# EAGLE design grbl_pendant_peripheral (EAGLE 6.6.0)
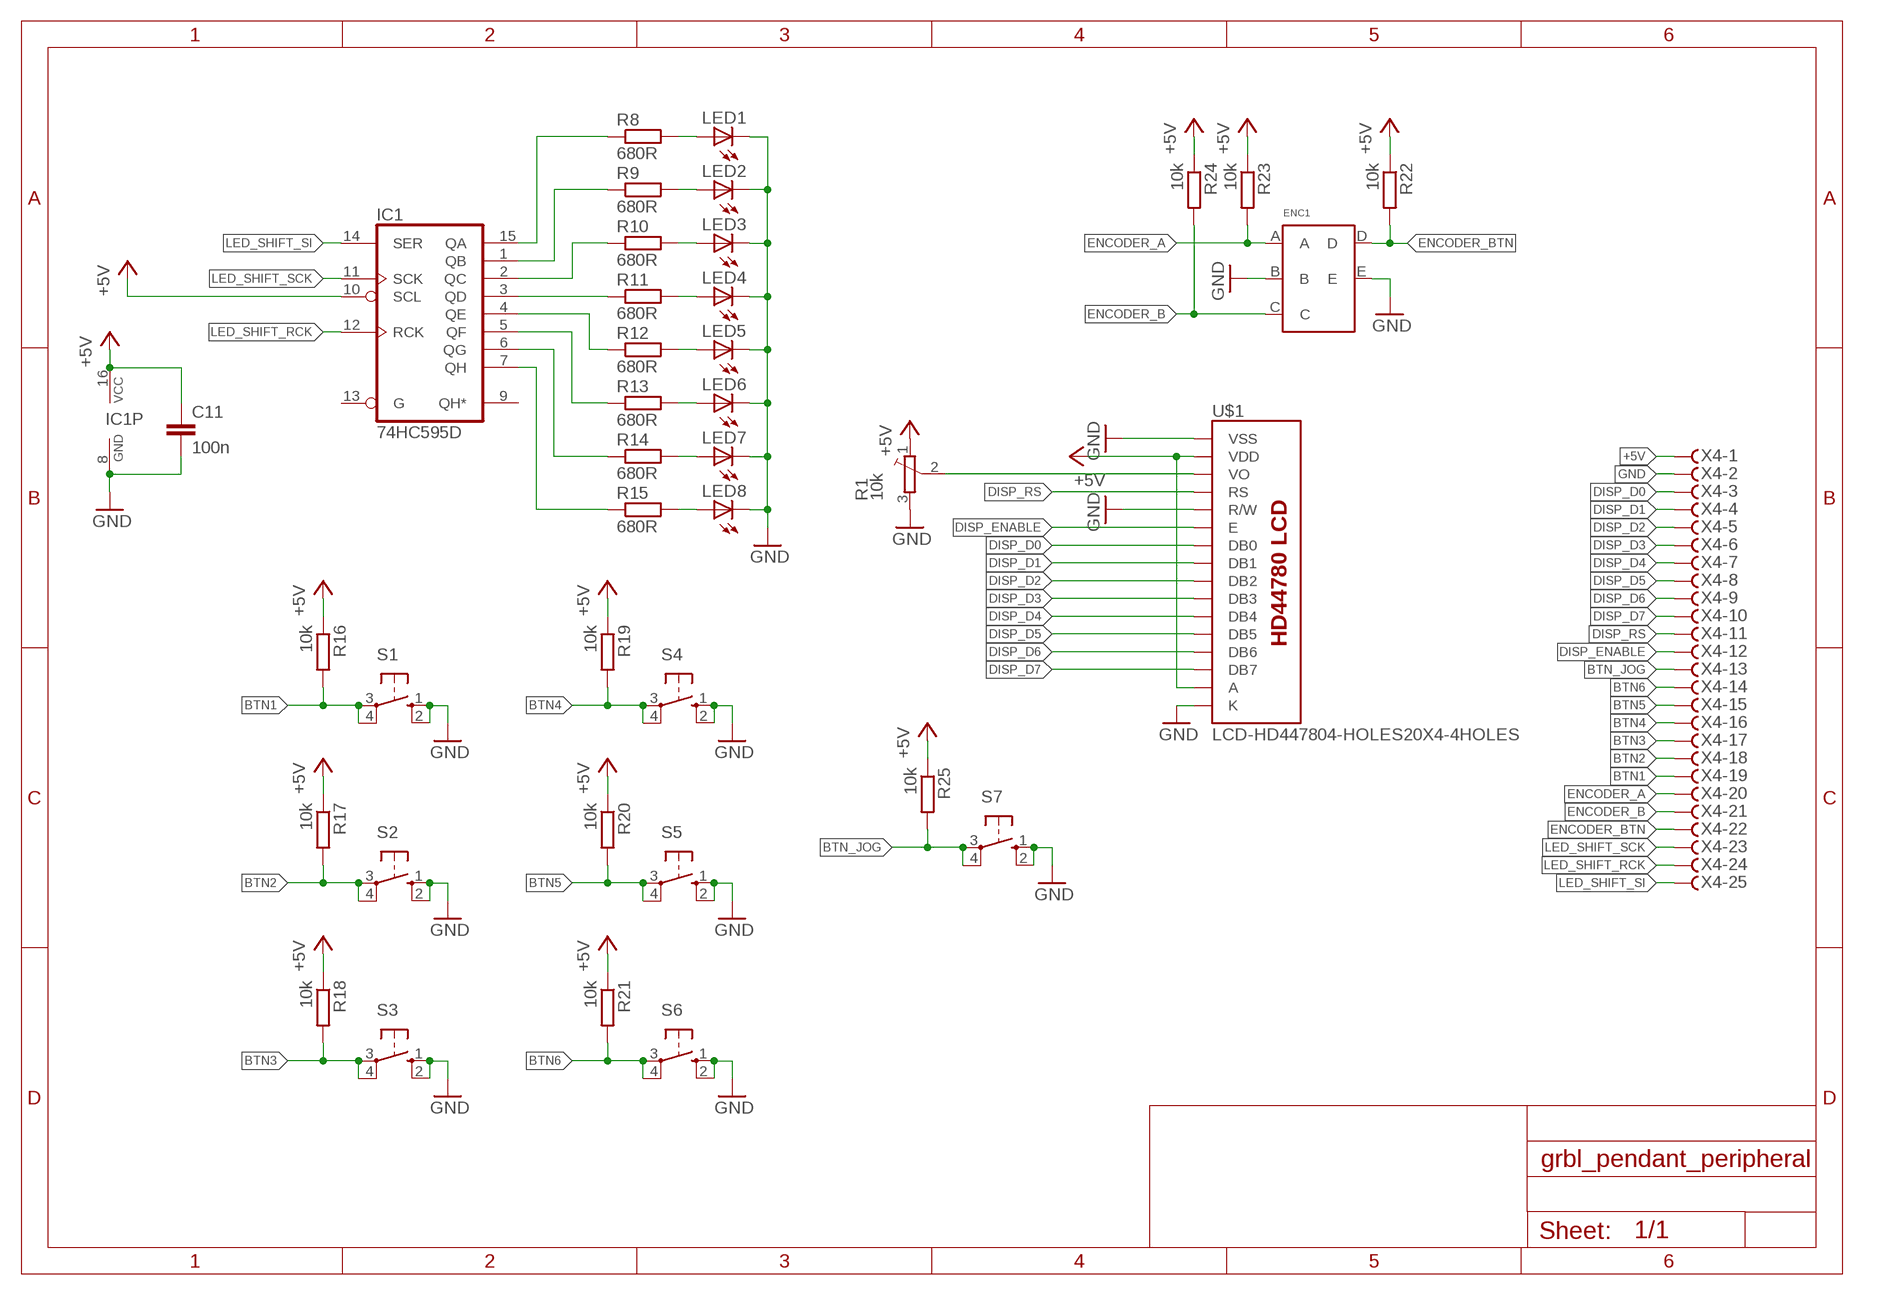
[diagram p0: schematic, sheet 1]

## Parts
C11  100n  C-EUC0603K  [C0603K]
ENC1  ENCODER  [ENCODER]
IC1  74HC595D  [SO16]
LED1  LED5MM  [LED5MM]
LED2  LED5MM  [LED5MM]
LED3  LED5MM  [LED5MM]
LED4  LED5MM  [LED5MM]
LED5  LED5MM  [LED5MM]
LED6  LED5MM  [LED5MM]
LED7  LED5MM  [LED5MM]
LED8  LED5MM  [LED5MM]
R1  10k  35WR5KLFTR  [35WR5KLFTR]
R8  680R  R-EU_R0603  [R0603]
R9  680R  R-EU_R0603  [R0603]
R10  680R  R-EU_R0603  [R0603]
R11  680R  R-EU_R0603  [R0603]
R12  680R  R-EU_R0603  [R0603]
R13  680R  R-EU_R0603  [R0603]
R14  680R  R-EU_R0603  [R0603]
R15  680R  R-EU_R0603  [R0603]
R16  10k  R-EU_R0603  [R0603]
R17  10k  R-EU_R0603  [R0603]
R18  10k  R-EU_R0603  [R0603]
R19  10k  R-EU_R0603  [R0603]
R20  10k  R-EU_R0603  [R0603]
R21  10k  R-EU_R0603  [R0603]
R22  10k  R-EU_R0603  [R0603]
R23  10k  R-EU_R0603  [R0603]
R24  10k  R-EU_R0603  [R0603]
R25  10k  R-EU_R0603  [R0603]
S1  10-XX  [B3F-10XX]
S2  10-XX  [B3F-10XX]
S3  10-XX  [B3F-10XX]
S4  10-XX  [B3F-10XX]
S5  10-XX  [B3F-10XX]
S6  10-XX  [B3F-10XX]
S7  10-XX  [B3F-10XX]
U$1  LCD-HD447804-HOLES20X4-4HOLES  [LCD-20X4-4HOLES]
X4  F25HPS  [F25HP]

## Nets
+5V: C11.1 IC1.10(SCL) IC1.16(VCC) R1.1(E) R16.1 R17.1 R18.1 R19.1 R20.1 R21.1 R22.1 R23.1 R24.1 R25.1 U$1.P$2(VDD) U$1.P$15(A) X4.1
BTN1: R16.2 S1.3(P) S1.4(P1) X4.19
BTN2: R17.2 S2.3(P) S2.4(P1) X4.18
BTN3: R18.2 S3.3(P) S3.4(P1) X4.17
BTN4: R19.2 S4.3(P) S4.4(P1) X4.16
BTN5: R20.2 S5.3(P) S5.4(P1) X4.15
BTN6: R21.2 S6.3(P) S6.4(P1) X4.14
BTN_JOG: R25.2 S7.3(P) S7.4(P1) X4.13
DISP_D0: U$1.P$7(DB0) X4.3
DISP_D1: U$1.P$8(DB1) X4.4
DISP_D2: U$1.P$9(DB2) X4.5
DISP_D3: U$1.P$10(DB3) X4.6
DISP_D4: U$1.P$11(DB4) X4.7
DISP_D5: U$1.P$12(DB5) X4.8
DISP_D6: U$1.P$13(DB6) X4.9
DISP_D7: U$1.P$14(DB7) X4.10
DISP_ENABLE: U$1.P$6(E) X4.12
DISP_RS: U$1.P$4(RS) X4.11
ENCODER_A: ENC1.A R23.2 X4.20
ENCODER_B: ENC1.C R24.2 X4.21
ENCODER_BTN: ENC1.D R22.2 X4.22
GND: C11.2 ENC1.B ENC1.E IC1.8(GND) LED1.K(C) LED2.K(C) LED3.K(C) LED4.K(C) LED5.K(C) LED6.K(C) LED7.K(C) LED8.K(C) R1.3(A) S1.1(S) S1.2(S1) S2.1(S) S2.2(S1) S3.1(S) S3.2(S1) S4.1(S) S4.2(S1) S5.1(S) S5.2(S1) S6.1(S) S6.2(S1) S7.1(S) S7.2(S1) U$1.P$1(VSS) U$1.P$5(R/W) U$1.P$16(K) X4.2
LED_SHIFT_RCK: IC1.12(RCK) X4.24
LED_SHIFT_SCK: IC1.11(SCK) X4.23
LED_SHIFT_SI: IC1.14(SER) X4.25
N$1: IC1.3(QD) R11.1
N$2: IC1.15(QA) R8.1
N$3: IC1.1(QB) R9.1
N$4: IC1.2(QC) R10.1
N$5: R1.2(S) U$1.P$3(VO)
N$6: IC1.4(QE) R12.1
N$9: IC1.5(QF) R13.1
N$10: IC1.6(QG) R14.1
N$11: IC1.7(QH) R15.1
N$12: LED1.A R8.2
N$13: LED2.A R9.2
N$14: LED3.A R10.2
N$15: LED4.A R11.2
N$16: LED5.A R12.2
N$17: LED6.A R13.2
N$18: LED7.A R14.2
N$19: LED8.A R15.2
Unconnected: IC1.9(QH*) IC1.13(G)

## Library data of the parts
C11 = rcl:C-EU: CAPACITOR, European symbol
ENC1 = encoder:ENCODER
IC1 = 74xx-eu:74*595: 8-bit SHIFT REGISTER, output latch
LED1-LED8 = led:LED: LED OSRAM: - CHIPLED LG R971, LG N971, LY N971, LG Q971, LY Q971, LO R971, LY R971 LH N974, LH R974 LS Q976, LO Q976, LY Q976 LO Q996 - Hyper CHIPLED LW Q18S LB Q993, LB Q99A, LB R99A - SideLED LS A670, LO A670, LY A670, LG A670, LP A670 LB A673, LV A673, LT A673, LW A673 LH A674 LY A675 LS A676, LA A676, LO A676, LY A676, LW A676 LS A679, LY A679, LG A679 - Hyper Micro SIDELED® LS Y876, LA Y876, LO Y876, LY Y876 LT Y87S - SmartLED LW L88C, LW L88S LB L89C, LB L89S, LG L890 LS L89K, LO L89K, LY L89K LS L896, LA L896, LO L896, LY L896 - TOPLED LS T670, LO T670, LY T670, LG T670, LP T670 LSG T670, LSP T670, LSY T670, LOP T670, LYG T670 LG T671, LOG T671, LSG T671 LB T673, LV T673, LT T673, LW T673 LH T674 LS T676, LA T676, LO T676, LY T676, LB T676, LH T676, LSB T676, LW T676 LB T67C, LV T67C, LT T67C, LS T67K, LO T67K, LY T67K, LW E67C LS E67B, LA E67B, LO E67B, LY E67B, LB E67C, LV E67C, LT E67C LW T67C LS T679, LY T679, LG T679 LS T770, LO T770, LY T770, LG T770, LP T770 LB T773, LV T773, LT T773, LW T773 LH T774 LS E675, LA E675, LY E675, LS T675 LS T776, LA T776, LO T776, LY T776, LB T776 LHGB T686 LT T68C, LB T68C - Hyper Mini TOPLED® LB M676 - Mini TOPLED Santana® LG M470 LS M47K, LO M47K, LY M47K Source: http://www.osram.convergy.de LUXEON: - LUMILED® LXK2-PW12-R00, LXK2-PW12-S00, LXK2-PW14-U00, LXK2-PW14-V00 LXK2-PM12-R00, LXK2-PM12-S00, LXK2-PM14-U00 LXK2-PE12-Q00, LXK2-PE12-R00, LXK2-PE12-S00, LXK2-PE14-T00, LXK2-PE14-U00 LXK2-PB12-K00, LXK2-PB12-L00, LXK2-PB12-M00, LXK2-PB14-N00, LXK2-PB14-P00, LXK2-PB14-Q00 LXK2-PR12-L00, LXK2-PR12-M00, LXK2-PR14-Q00, LXK2-PR14-R00 LXK2-PD12-Q00, LXK2-PD12-R00, LXK2-PD12-S00 LXK2-PH12-R00, LXK2-PH12-S00 LXK2-PL12-P00, LXK2-PL12-Q00, LXK2-PL12-R00 Source: www.luxeon.com KINGBRIGHT: KA-3528ASYC Source: www.kingbright.com
R1 = SchlegelAr_Master:35WR5KLFTR: 35WR5KLFTR - Trimmerwiderstände – SMD 5K OHM 3MM ST CERM last modified: Armin Schlegel, 28.04.2014 http://de.mouser.com/ProductDetail/BI-Technologies-TT-electronics/35WR5KLFTR/?qs=sGAEpiMZZMvygUB3GLcD7k0onkdf2zwbjj6v9Mqce6o%3d http://www.mouser.com/ds/2/414/35-2231.pdf
R8-R25 = rcl:R-EU_: RESISTOR, European symbol
S1-S7 = switch-omron:10-XX: OMRON SWITCH; MPN: B3F-1000; OC_FARNELL: 176432; OC_NEWARK: 36M3542
U$1 = HD44780LCD:LCD-HD44780
X4 = con-subd:F25?S: SUB-D; OC_FARNELL: unknown; OC_NEWARK: unknown

## Board
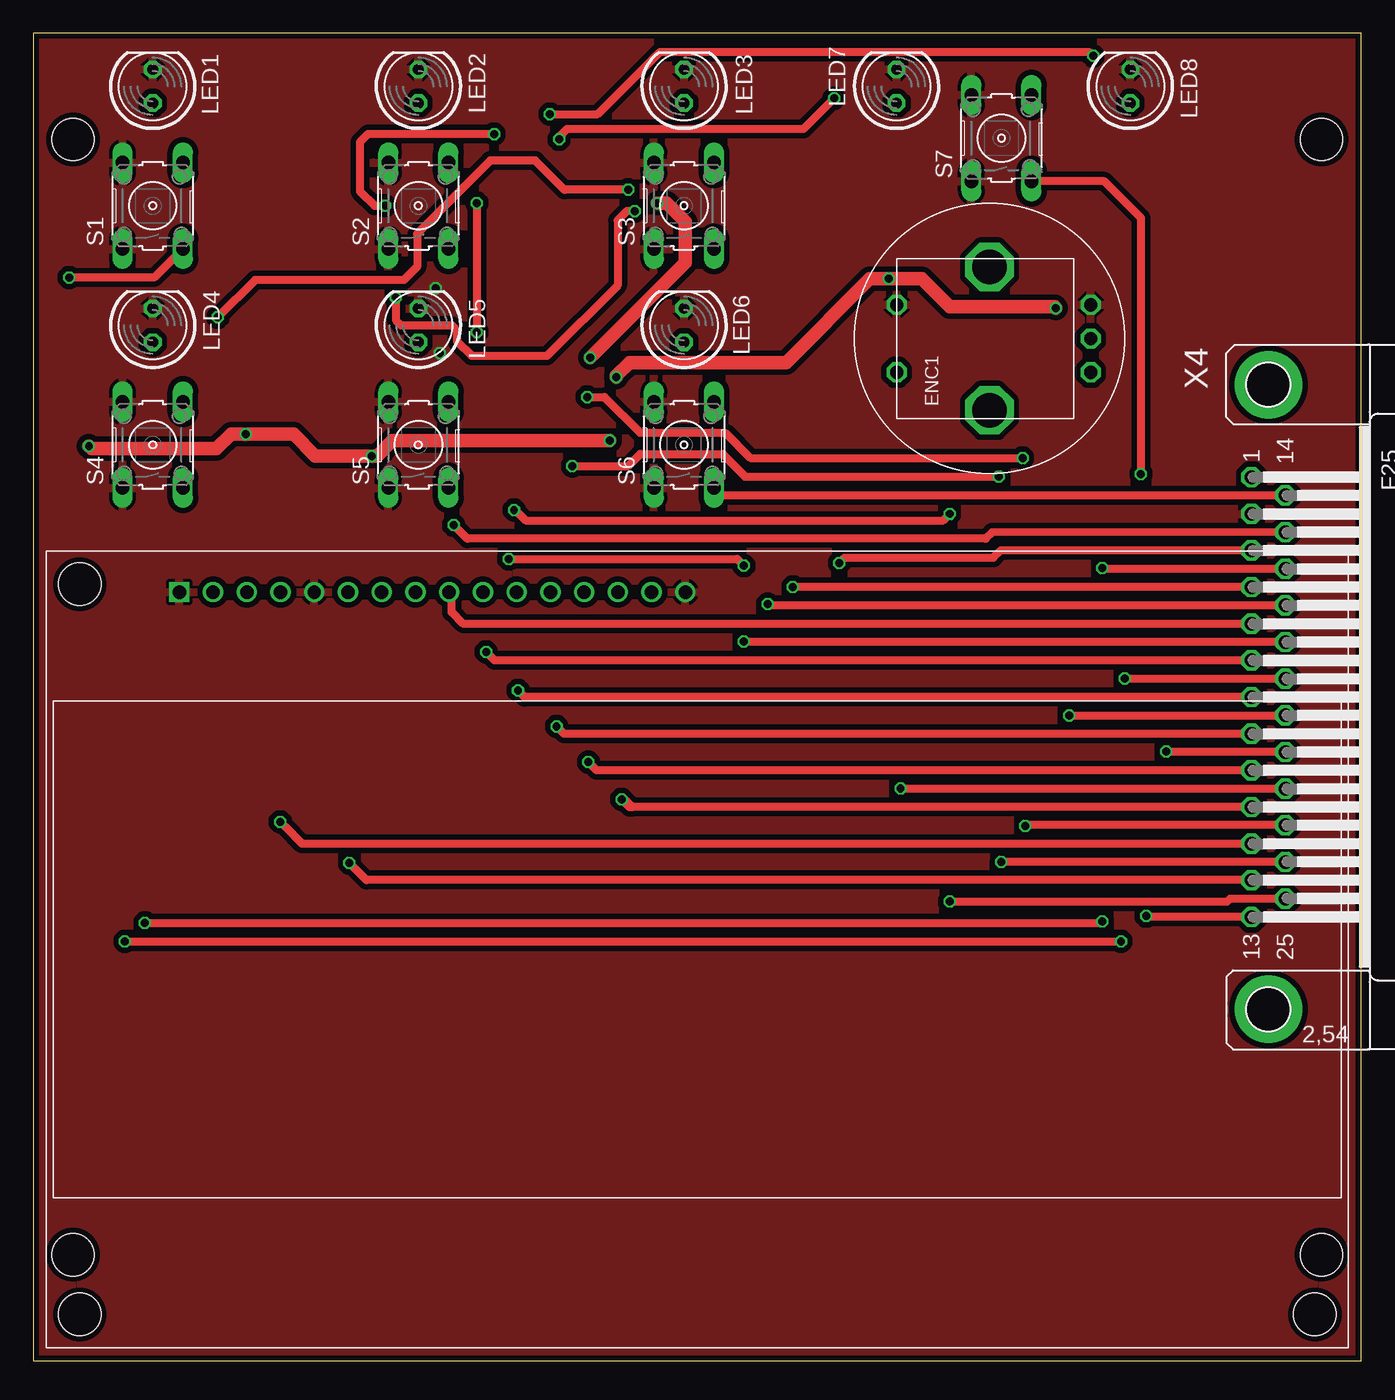
[diagram p1: board, top side]
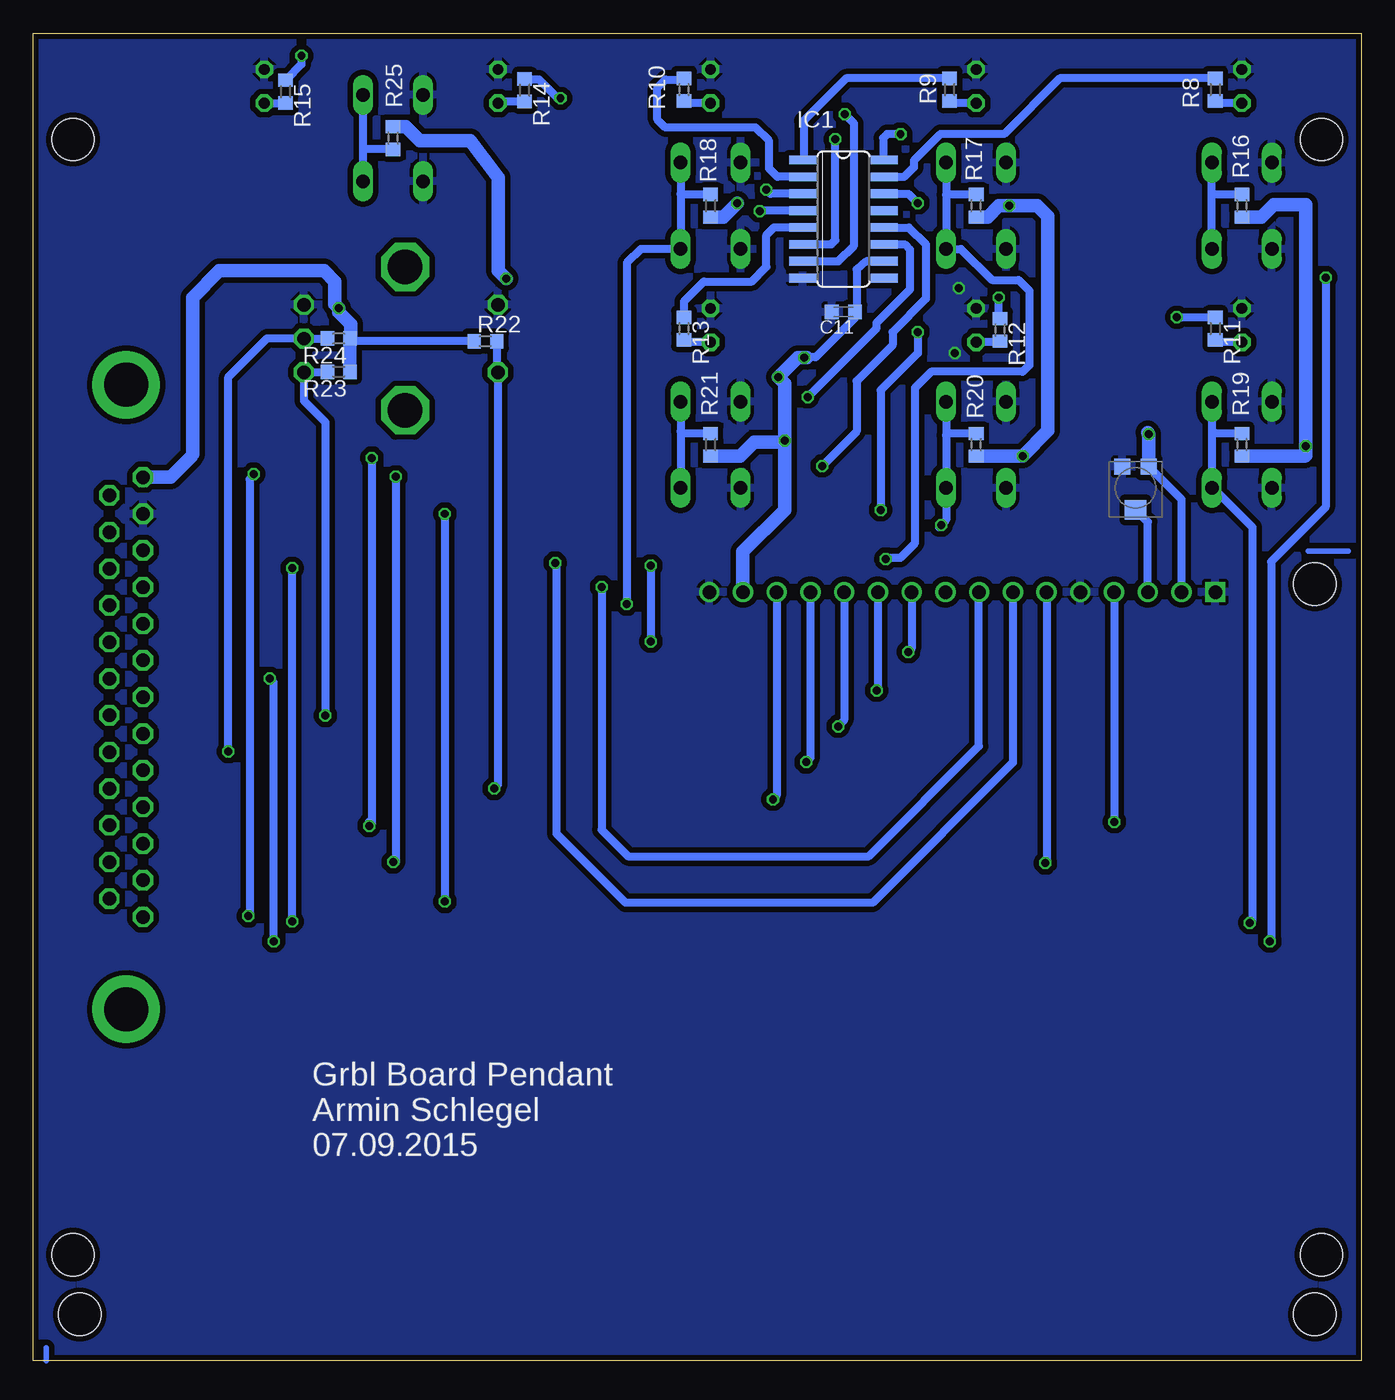
[diagram p2: board, bottom side, seen from below]

Size 100 x 100 mm. Coordinates in mm from the lower left corner, seen from the top.
Outline: 0,0 100,0 100,100 0,100 0,0
Copper layers (1*16): Top 0.035mm / dielectric 1.5mm / Bottom 0.035mm
Design rules "Elecrow_2-layer_eagle_rule": minimum track width 6mil, minimum drill 12mil, track to track 6mil, track to pad 6mil, pad to pad 6mil, via to via 6mil, smd to smd 0mil, copper to edge 10mil, drill to drill 10mil, minimum pad ring 10mil, minimum via ring 6mil, stop-mask expansion 2mil, vias tented up to drill 100mil, thermal gap 10mil
Holes 3.2 mm at 3,92 97,92 97,8 3,8

### Footprints (pad centres in the part's own frame; a part is rotated, then mirrored left to right if it is on the bottom)
C0603K = smd 1.05 x 1.08: 1 -0.875,0; 2 0.875,0
ENCODER = drill 1 octagon: A -2.54,-7.62; B 2.54,-7.62; C 0,-7.62; D -2.54,6.985; E 2.54,6.985 | drill 2.6 octagon: P$1 5.397,0; P$2 -5.397,0
SO16 = smd 0.66 x 2.032: 1 -4.445,-3.073; 2 -3.175,-3.073; 3 -1.905,-3.073; 4 -0.635,-3.073; 5 0.635,-3.073; 6 1.905,-3.073; 7 3.175,-3.073; 8 4.445,-3.073; 9 4.445,3.073; 10 3.175,3.073; 11 1.905,3.073; 12 0.635,3.073; 13 -0.635,3.073; 14 -1.905,3.073; 15 -3.175,3.073; 16 -4.445,3.073
LED5MM = drill 0.813 octagon: A -1.27,0; K 1.27,0
35WR5KLFTR = smd 1.2 x 1.2: 1 -1.6,1; 3 -1.6,-1 | smd 1.5 x 1.6: 2 1.65,0
R0603 = smd 1 x 1.1: 1 -0.85,0; 2 0.85,0
B3F-10XX = drill 1.016 long: 1 -3.251,2.261; 2 3.251,2.261; 3 -3.251,-2.261; 4 3.251,-2.261
LCD-20X4-4HOLES = drill 1.016 square: P$1 10,56.9 | drill 1.016: P$2 12.54,56.9; P$3 15.08,56.9; P$4 17.62,56.9; P$5 20.16,56.9; P$6 22.7,56.9; P$7 25.24,56.9; P$8 27.78,56.9; P$9 30.32,56.9; P$10 32.86,56.9; P$11 35.4,56.9; P$12 37.94,56.9; P$13 40.48,56.9; P$14 43.02,56.9; P$15 45.56,56.9; P$16 48.1,56.9 | hole 3.2: 2.5,2.5; 2.5,57.5; 95.5,2.5
F25HP = drill 1.016 octagon: 1 -16.561,-1.27; 2 -13.792,-1.27; 3 -11.049,-1.27; 4 -8.28,-1.27; 5 -5.512,-1.27; 6 -2.769,-1.27; 7 0,-1.27; 8 2.769,-1.27; 9 5.512,-1.27; 10 8.28,-1.27; 11 11.049,-1.27; 12 13.792,-1.27; 13 16.561,-1.27; 14 -15.189,1.27; 15 -12.421,1.27; 16 -9.652,1.27; 17 -6.909,1.27; 18 -4.14,1.27; 19 -1.372,1.27; 20 1.372,1.27; 21 4.14,1.27; 22 6.909,1.27; 23 9.652,1.27; 24 12.421,1.27; 25 15.189,1.27 | drill 3.302 pad 5.08: G1 -23.52,0; G2 23.52,0

### Placement (x,y rotation side)
C11  39,79 180 bottom
ENC1  72,77 90 top
IC1  39,86 270 bottom
LED1  9,96 90 top
LED2  29,96 90 top
LED3  49,96 90 top
LED4  9,78 90 top
LED5  29,78 90 top
LED6  49,78 90 top
LED7  65,96 90 top
LED8  82.6,96 90 top
R1  17,65.75 270 bottom
R8  11,95.75 270 bottom
R9  31,95.75 270 bottom
R10  51,95.75 270 bottom
R11  11,77.75 270 bottom
R12  27.2,77.65 270 bottom
R13  51,77.75 270 bottom
R14  63,95.7 270 bottom
R15  81,95.6 270 bottom
R16  9,87 90 bottom
R17  29,87 90 bottom
R18  49,87 90 bottom
R19  9,69 90 bottom
R20  29,69 90 bottom
R21  49,69 90 bottom
R22  65.95,76.8 0 bottom
R23  77,74.5 180 bottom
R24  77,77 180 bottom
R25  72.9,92.1 270 bottom
S1  9,87 90 top
S2  29,87 90 top
S3  49,87 90 top
S4  9,69 90 top
S5  29,69 90 top
S6  49,69 90 top
S7  72.9,92.1 90 top
U$1  1,1 0 top
X4  93,50 270 top

### Tracks (layer width: path | path; a pad name or v marks a point on that pad's centre or on a via)
+5V  (via drill 0.6)
  Top 0.61: v34.7,92.4 25.2,92.4 24.6,91.8 24.6,88.1 25.7,87 v26.5,87
  Top 1.016: v4.2,68.9 4.4,68.7 13.8,68.7 14.9,69.8 v16,69.8 19.6,69.8 21.25,68.15 v25.5,68.15 25.9,68.15 27.05,69.3 v43.4,69.3 | v47,87.2 47.7,87.2 49.1,85.8 49.1,82.7 v41.95,75.55 | v43.9,74.1 43.9,74.2 44.9,75.2 56.7,75.2 63,81.5 v64.4,81.5 66.9,81.5 69,79.4 76.9,79.4 v77,79.3
  Bottom 0.61: U$1.P$2 13.54,64.89 R1.1 | v34.7,92.4 35.7,92.4 36,92.1 36,90.52 IC1.16 | IC1.10 37.27,82.83 38,82.2 38,79.12 C11.1 38.12,78.58 41.1,75.6 41.9,75.6 v41.95,75.55 | R22.1 75.95,76.8 R24.1 | 88.1,68.1 88.1,68.2 88,68.3
  Bottom 1.016: R16.1 7.55,86.15 6.6,87.1 4.2,87.1 v4.2,68.9 4.2,68.2 4.25,68.15 R19.1 | R20.1 v25.5,68.15 23.6,70.05 23.6,86.2 24.4,87 v26.5,87 27.3,87 28.15,86.15 R17.1 | 16.1,69.9 v16,69.8 R1.1 | R18.1 48.05,86.15 v47,87.2 | v43.4,69.3 43.4,73.6 v43.9,74.1 42.45,75.55 v41.95,75.55 41.75,75.55 | v43.4,69.3 43.4,69.15 | R23.1 R24.1 | R24.1 76.15,77.15 | R25.1 71.95,92.95 70.9,91.9 67.1,91.9 65,89.1 65,82.1 v64.4,81.5 | U$1.P$15 46.56,60.94 43.4,64.1 v43.4,69.3 | R24.1 76.1,77.05 76.1,78.1 77,79 v77,79.3 77.3,79.6 77.3,81.3 78.1,82.1 86,82.1 88,80.1 88,68.3 | X4.1 89.64,66.56 88.1,68.1 | R21.1 46.75,68.15 45.7,69.2 43.5,69.2 v43.4,69.3
BTN1  (via drill 0.6)
  Top 0.61: S1.3 9.1,81.6 v2.7,81.6 | v6.9,31.6 v81.9,31.6 | v82.2,51.4 94.24,51.4 X4.19
  Bottom 0.61: S1.3 11.26,88 | 11.26,88 S1.4 | R16.2 11.11,87.85 11.26,88 | v2.7,81.6 2.7,64.3 6.8,60.2 6.8,31.7 v6.9,31.6 | v81.9,31.6 81.9,51.1 v82.2,51.4
BTN2  (via drill 0.6)
  Top 0.61: v35.8,60.4 53,60.4 v53.5,59.9 | X4.18 53.56,54.14 v53.5,54.2
  Bottom 0.61: S2.4 31.26,87.8 | 31.26,87.8 S2.3 30.15,83.75 27.8,81.4 25.8,81.4 25,80.6 25,75 25.5,74.5 32.4,74.5 33.6,73.3 33.6,61.6 34.7,60.5 35.7,60.5 v35.8,60.4 | R17.2 31.21,87.85 31.26,87.8 | v53.5,59.9 v53.5,54.2
BTN3  (via drill 0.6)
  Top 0.61: 55.4,56.9 v55.3,57 55.39,56.91 X4.17
  Bottom 0.61: S3.4 51.26,87.9 | 51.26,87.9 S3.3 54.25,83.75 55.3,82.7 v55.3,57 | R18.2 51.21,87.85 51.26,87.9
BTN4  (via drill 0.6)
  Top 0.61: v8.4,33 80.4,33 v80.5,33.1 | X4.16 80.55,59.65 v80.5,59.7
  Bottom 0.61: S4.4 11.26,70.1 | 11.26,70.1 S4.3 11.15,65.75 8.2,62.8 8.2,33.2 v8.4,33 | R19.2 11.01,69.85 11.26,70.1 | v80.5,33.1 v80.5,59.7
BTN5  (via drill 0.6)
  Top 0.61: X4.15 72.2,62.4 71.72,61.92 32.68,61.92 v31.65,62.95
  Bottom 0.61: S5.4 31.26,69.7 | 31.26,69.7 S5.3 31.26,63.34 v31.65,62.95 31.8,62.8 | R20.2 31.11,69.85 31.26,69.7
BTN6
  Top 0.61: X4.14 51.82,65.19 S6.3
  Bottom 0.61: S6.4 51.26,70 | 51.26,70 S6.3 | R21.2 51.11,69.85 51.26,70
BTN_JOG  (via drill 0.6)
  Top 0.61: X4.13 83.86,33.44 v83.8,33.5 | v83.4,66.8 83.4,86.1 80.65,88.85 S7.3
  Bottom 0.61: S7.3 75.16,91.2 | 75.16,91.2 S7.4 | R25.2 75.11,91.25 75.16,91.2 | v83.4,66.8 83.4,66.7 83.7,66.4 83.7,33.6 v83.8,33.5
DISP_D0  (via drill 0.6)
  Top 0.61: v60.7,60.1 61.1,60.5 72.3,60.5 72.85,61.05 X4.3
  Bottom 0.61: U$1.P$7 26.24,45.06 36.8,34.5 55.4,34.5 60.6,39.7 60.6,60 v60.7,60.1
DISP_D1  (via drill 0.6)
  Top 0.61: X4.4 57.22,58.28 v57.2,58.3
  Bottom 0.61: v57.2,58.3 57.2,40 55.2,38 37.1,38 28.8,46.3 28.8,57.88 U$1.P$8
DISP_D2
  Top 0.61: X4.5 32.39,55.51 31.5,56.4 31.5,57.72 U$1.P$9
DISP_D3  (via drill 0.6)
  Top 0.61: X4.6 34.73,52.77 34.5,53 v34.1,53.4
  Bottom 0.61: U$1.P$10 33.86,53.64 v34.1,53.4
DISP_D4  (via drill 0.6)
  Top 0.61: X4.7 37,50 36.85,50.15 v36.5,50.5
  Bottom 0.61: U$1.P$11 36.4,50.6 v36.5,50.5
DISP_D5  (via drill 0.6)
  Top 0.61: X4.8 39.97,47.23 39.8,47.4 v39.4,47.8
  Bottom 0.61: U$1.P$12 38.94,48.26 v39.4,47.8
DISP_D6  (via drill 0.6)
  Top 0.61: X4.9 42.41,44.49 42.2,44.7 v41.8,45.1
  Bottom 0.61: U$1.P$13 41.48,45.42 v41.8,45.1
DISP_D7  (via drill 0.6)
  Top 0.61: X4.10 45.1,41.72 | 45.1,41.72 44.88,41.72 v44.3,42.3 44.52,42.3 45.1,41.72
  Bottom 0.61: U$1.P$14 44.02,42.58 v44.3,42.3
DISP_ENABLE  (via drill 0.6)
  Top 0.61: X4.12 25.09,36.21 v23.8,37.5
  Bottom 0.61: U$1.P$6 23.7,37.6 v23.8,37.5
DISP_RS  (via drill 0.6)
  Top 0.61: X4.11 20.25,38.95 19,40.2 v18.6,40.6
  Bottom 0.61: U$1.P$4 18.62,40.62 v18.6,40.6
ENCODER_A  (via drill 0.6)
  Top 0.61: v78,48.6 94.24,48.6 X4.20
  Bottom 0.61: R23.2 77.89,74.46 ENC1.A 79.62,72.32 78,70.7 v78,48.6
ENCODER_B  (via drill 0.6)
  Top 0.61: X4.21 85.34,45.86 v85.3,45.9
  Bottom 0.61: R24.2 ENC1.C 82.4,77 85.3,74.1 v85.3,45.9
ENCODER_BTN  (via drill 0.6)
  Top 0.61: v65.3,43.1 X4.22
  Bottom 0.61: v65.3,43.1 65.02,43.38 ENC1.D 65.1,74.55 R22.2
GND  (via drill 0.6)
  other vias: 30.3,80.8 30.6,75.9
  pour Bottom (isolate 0.406): 0,99.9 100,99.9 100,0 0,0
  pour Top (isolate 0.406): 0,100 100,100 100,0 0,0
LED_SHIFT_RCK  (via drill 0.6)
  Top 0.61: v40.6,67.4 44.8,67.4 45.7,68.3 51.9,68.3 53.6,66.6 v72.7,66.6 | X4.24 v72.9,37.58 72.72,37.58 72.7,37.6
  Bottom 0.61: IC1.12 34.06,85.36 32.8,84.1 32.8,80 35.3,77.5 35.3,76.5 38,73.8 38,70 v40.6,67.4 | v72.7,66.6 72.7,37.6 72.88,37.6 v72.9,37.58
LED_SHIFT_SCK  (via drill 0.6)
  Top 0.61: v41.7,72.6 43,72.6 45.7,69.9 52.1,69.9 54,68 v74.5,68 | X4.23 74.75,40.35 v74.7,40.3
  Bottom 0.61: IC1.11 34.4,84.09 34,83.7 34,80.7 36.5,78.2 36.5,77.8 v41.7,72.6 | v74.5,68 74.5,40.8 | 74.5,40.8 74.5,40.5 v74.7,40.3 74.7,40.6 74.5,40.8
LED_SHIFT_SI  (via drill 0.6)
  Top 0.61: v33.4,87.2 v33.4,77.5 | v36.2,64.1 36.3,64.1 37.1,63.3 68.5,63.3 v69,63.8 | v69,34.6 89.9,34.6 90.11,34.81 X4.25
  Bottom 0.61: IC1.14 34.1,87.91 v33.4,87.2 | v33.4,77.5 33.4,75.9 36.2,73.1 v36.2,64.1 | v69,63.8 v69,34.6
N$1  (via drill 0.6)
  Top 0.61: v13.9,78.6 16.7,81.4 27.9,81.4 28.9,82.4 28.9,84.9 34.4,90.4 37.8,90.4 40,88.2 v44.8,88.2
  Bottom 0.61: IC1.3 44.51,87.91 v44.8,88.2 | v13.9,78.6 R11.1
N$2
  Bottom 0.61: R8.1 22.7,96.6 26.9,92.4 31.7,92.4 33.7,90.4 33.7,89.9 34.42,89.17 IC1.15
N$3
  Bottom 0.61: R9.1 38.8,96.6 42,93.4 42,90.52 IC1.1
N$4
  Bottom 0.61: IC1.2 43.98,89.17 44.6,89.8 44.6,91.9 45.6,92.9 52.4,92.9 53,93.5 53,95.9 52.4,96.5 51.1,96.5 R10.1
N$5
  Bottom 0.61: U$1.P$3 16.08,63.18 R1.2
N$6  (via drill 0.6)
  Top 0.61: v45.3,86.6 44.7,86.6 44,85.9 44,81 38.7,75.7 33,75.7 31.9,76.8 31.9,77.6 31.5,78 27.7,78 27.3,78.4 v27.3,80.1
  Bottom 0.61: IC1.4 45.27,86.64 v45.3,86.6 | R12.1 27.3,78.6 v27.3,80.1
N$7
  Bottom 0.406: 1,61 4,61
N$9
  Bottom 0.61: R13.1 51,79.8 49.5,81.3 45.9,81.3 44.8,82.4 44.8,84.8 44.23,85.36 IC1.5
N$10  (via drill 0.6)
  Top 0.61: v39.6,92 39.6,92.2 40.2,92.8 58,92.8 v60.3,95.1
  Bottom 0.61: IC1.6 39.91,84.09 39.6,84.4 v39.6,92 | v60.3,95.1 60.5,95.1 61.9,96.5 62.95,96.5 R14.1
N$11  (via drill 0.6)
  Top 0.61: v38.9,93.9 42.5,93.9 47.2,98.6 79.5,98.6 v79.8,98.3
  Bottom 0.61: IC1.7 39.38,82.83 38.2,84 38.2,93.2 v38.9,93.9 | v79.8,98.3 79.8,97.65 R15.1
N$12
  Bottom 0.61: LED1.A 10.83,94.73 R8.2
N$13
  Bottom 0.61: LED2.A 30.83,94.73 R9.2
N$14
  Bottom 0.61: LED3.A 50.83,94.73 R10.2
N$15
  Bottom 0.61: LED4.A 10.83,76.73 R11.2
N$16
  Bottom 0.61: R12.2 27.27,76.73 LED5.A
N$17
  Bottom 0.61: LED6.A 50.83,76.73 R13.2
N$18
  Bottom 0.61: R14.2 64.88,94.85 LED7.A
N$19
  Bottom 0.61: LED8.A 81.02,94.73 R15.2
N$20
  Bottom 0.406: 99,1 99,0

### Text on the board
bNames: Grbl Board Pendant / Armin Schlegel / 07.09.2015